# Altium schematic sheet smart-ring-main.SchDoc
size A2
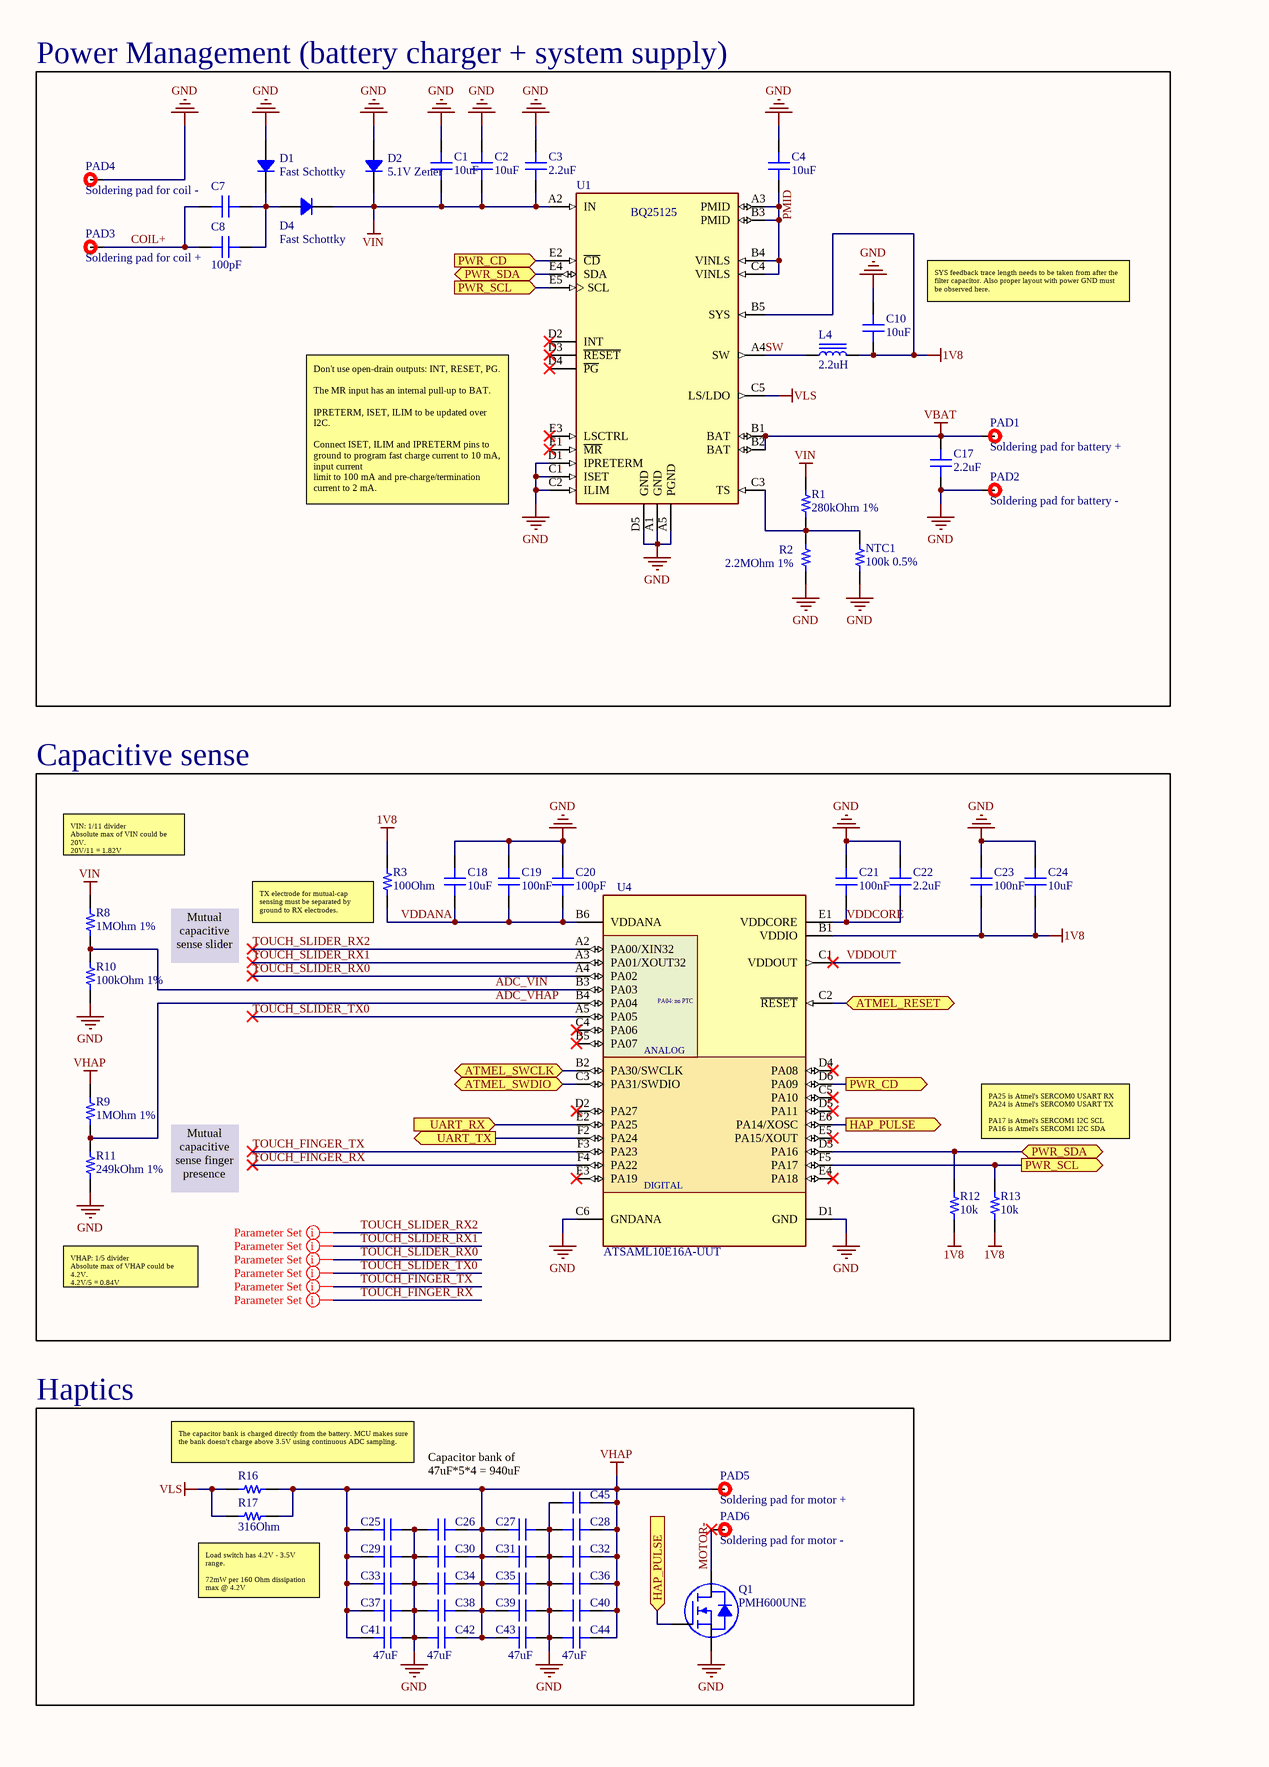
[diagram p0: smart-ring-main.SchDoc, left]
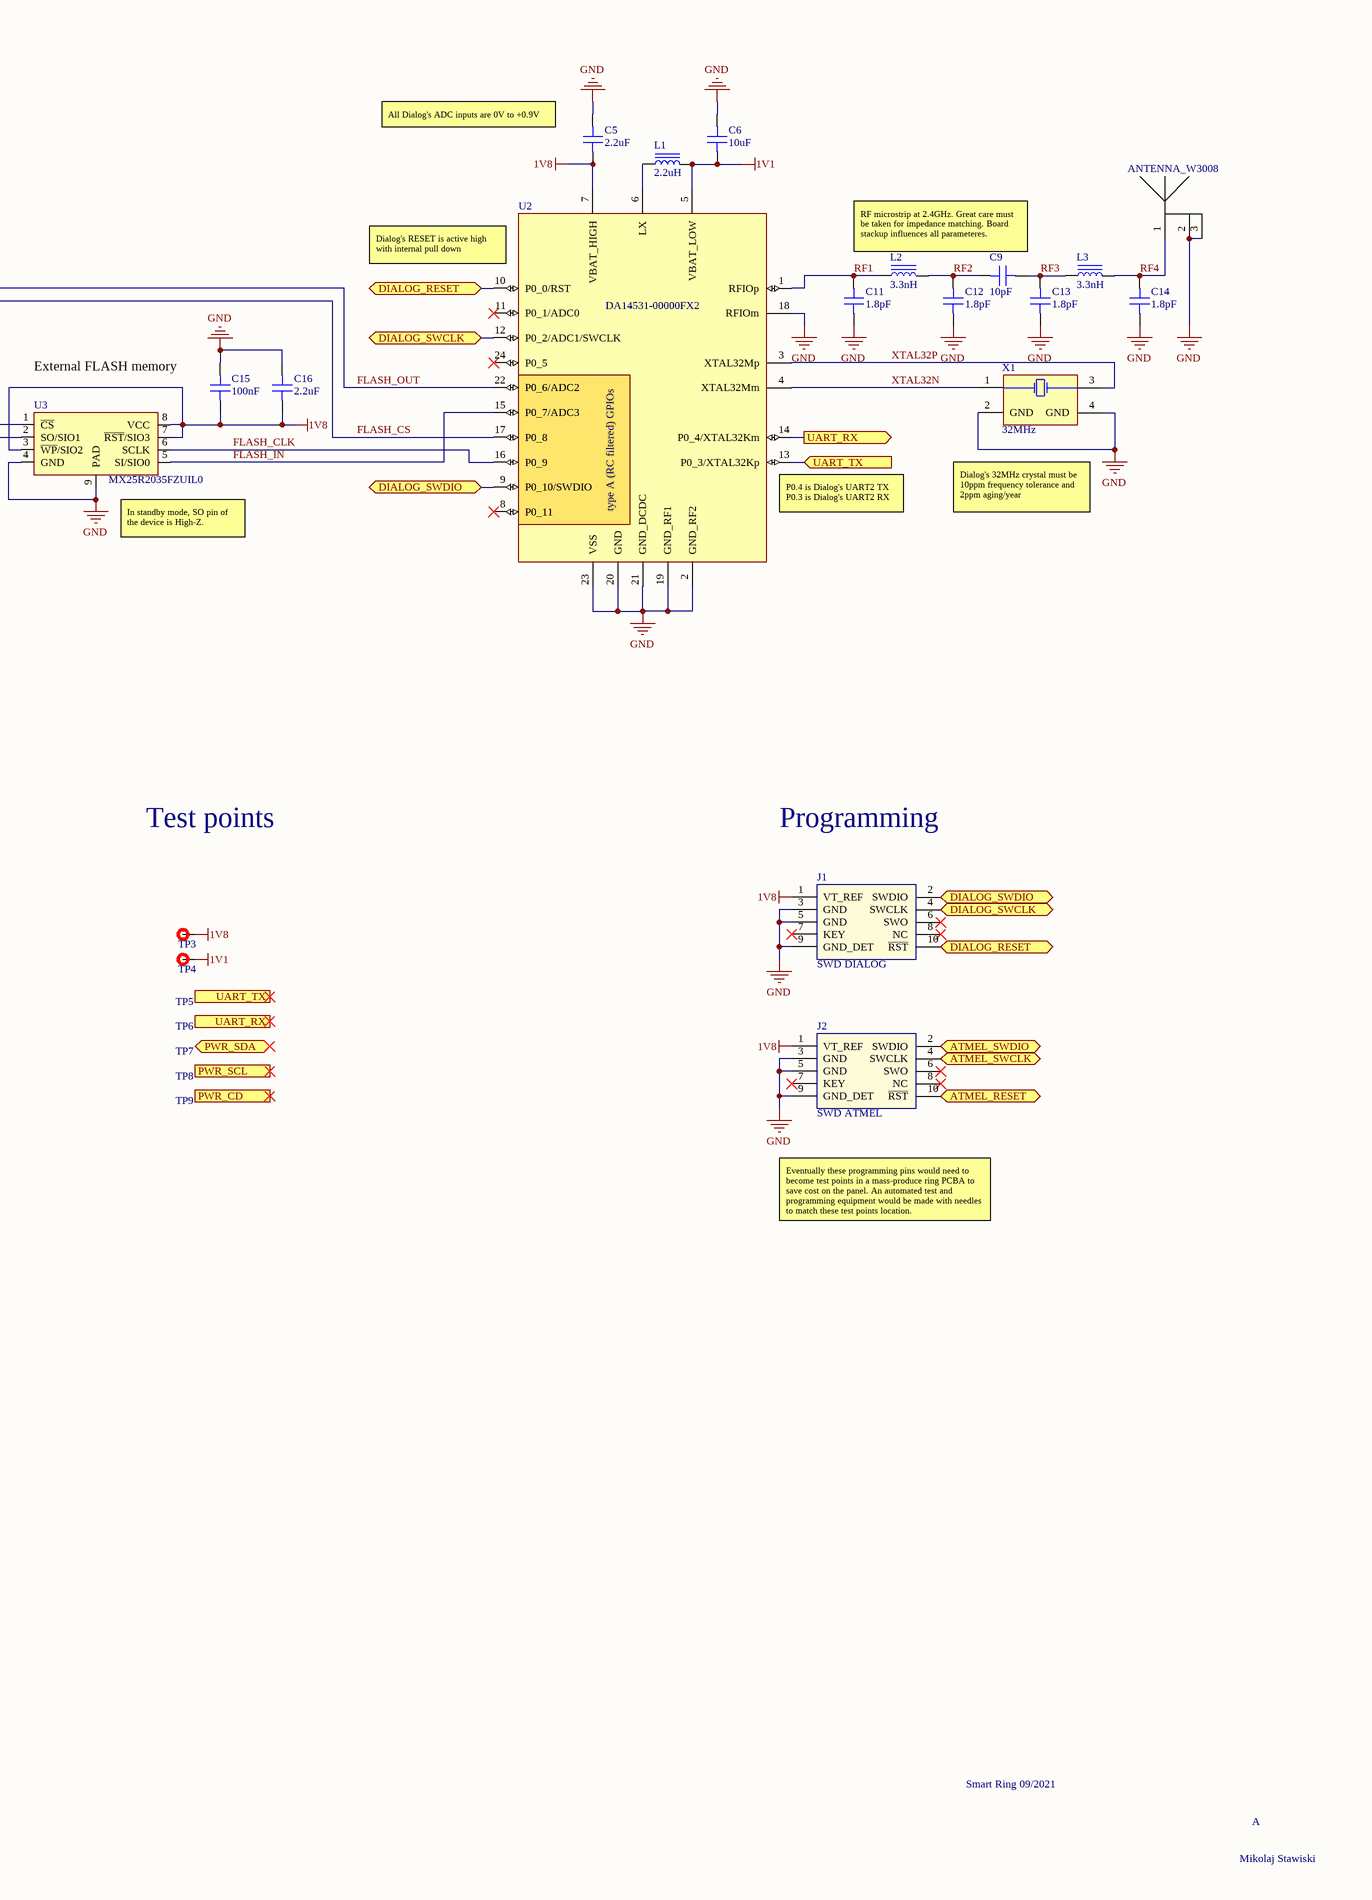
[diagram p1: smart-ring-main.SchDoc, right]

## Parts
C1  10uF  [SMD_CAPACITOR_0402]
C2  10uF  [SMD_CAPACITOR_0402]
C3  2.2uF  [SMD_CAPACITOR_0402]
C4  10uF  [SMD_CAPACITOR_0402]
C5  2.2uF  [SMD_CAPACITOR_0402]
C6  10uF  [SMD_CAPACITOR_0402]
C7  100pF  [SMD_CAPACITOR_0201]  (value not drawn)
C8  100pF  [SMD_CAPACITOR_0201]
C9  10pF  [SMD_CAPACITOR_0201]
C10  10uF  [SMD_CAPACITOR_0402]
C11  1.8pF  [SMD_CAPACITOR_0201]
C12  1.8pF  [SMD_CAPACITOR_0201]
C13  1.8pF  [SMD_CAPACITOR_0201]
C14  1.8pF  [SMD_CAPACITOR_0201]
C15  100nF  [SMD_CAPACITOR_0201]
C16  2.2uF  [SMD_CAPACITOR_0402]
C17  2.2uF  [SMD_CAPACITOR_0402]
C18  10uF  [SMD_CAPACITOR_0402]
C19  100nF  [SMD_CAPACITOR_0201]
C20  100pF  [SMD_CAPACITOR_0201]
C21  100nF  [SMD_CAPACITOR_0201]
C22  2.2uF  [SMD_CAPACITOR_0402]
C23  100nF  [SMD_CAPACITOR_0201]
C24  10uF  [SMD_CAPACITOR_0402]
C25  47uF  [SMD_CAPACITOR_0603]  (value not drawn)
C26  47uF  [SMD_CAPACITOR_0603]  (value not drawn)
C27  47uF  [SMD_CAPACITOR_0603]  (value not drawn)
C28  47uF  [SMD_CAPACITOR_0603]  (value not drawn)
C29  47uF  [SMD_CAPACITOR_0603]  (value not drawn)
C30  47uF  [SMD_CAPACITOR_0603]  (value not drawn)
C31  47uF  [SMD_CAPACITOR_0603]  (value not drawn)
C32  47uF  [SMD_CAPACITOR_0603]  (value not drawn)
C33  47uF  [SMD_CAPACITOR_0603]  (value not drawn)
C34  47uF  [SMD_CAPACITOR_0603]  (value not drawn)
C35  47uF  [SMD_CAPACITOR_0603]  (value not drawn)
C36  47uF  [SMD_CAPACITOR_0603]  (value not drawn)
C37  47uF  [SMD_CAPACITOR_0603]  (value not drawn)
C38  47uF  [SMD_CAPACITOR_0603]  (value not drawn)
C39  47uF  [SMD_CAPACITOR_0603]  (value not drawn)
C40  47uF  [SMD_CAPACITOR_0603]  (value not drawn)
C41  47uF  [SMD_CAPACITOR_0603]
C42  47uF  [SMD_CAPACITOR_0603]
C43  47uF  [SMD_CAPACITOR_0603]
C44  47uF  [SMD_CAPACITOR_0603]
C45  47uF  [SMD_CAPACITOR_0603]  (value not drawn)
D1  Fast Schottky  [CLP0603-2M]
D2  5.1V Zener  [DFN1006-2A]
D4  Fast Schottky  [CLP0603-2M]
J1  SWD DIALOG  [CONN_SWD_10PIN]
J2  SWD ATMEL  [CONN_SWD_10PIN]
L1  2.2uH  [SMD_INDUCTOR_0603]
L2  3.3nH  [SMD_INDUCTOR_0201]
L3  3.3nH  [SMD_INDUCTOR_0201]
L4  2.2uH  [SMD_INDUCTOR_0603_HDI]
NTC1  100k 0.5%  [SMD_RESISTOR_0402]
PAD1  Soldering pad for battery +  (graphical)
PAD2  Soldering pad for battery -  (graphical)
PAD3  Soldering pad for coil +  (graphical)
PAD4  Soldering pad for coil -  (graphical)
PAD5  Soldering pad for motor +  (graphical)
PAD6  Soldering pad for motor -  (graphical)
Q1  PMH600UNE  [DFN0606-3 (SOT8001)]
R1  280kOhm 1%  [SMD_RESISTOR_0201]
R2  2.2MOhm 1%  [SMD_RESISTOR_0201]
R3  100Ohm  [SMD_RESISTOR_0201]
R8  1MOhm 1%  [SMD_RESISTOR_0201]
R9  1MOhm 1%  [SMD_RESISTOR_0201]
R10  100kOhm 1%  [SMD_RESISTOR_0201]
R11  249kOhm 1%  [SMD_RESISTOR_0201]
R12  10k  [SMD_RESISTOR_0201]
R13  10k  [SMD_RESISTOR_0201]
R16  316Ohm  [SMD_RESISTOR_0201]  (value not drawn)
R17  316Ohm  [SMD_RESISTOR_0201]
TP3  Testpoint  [Testpoint 1.5x2.5mm]  (value not drawn)
TP4  Testpoint  [Testpoint 1.5x2.5mm]  (value not drawn)
U1  BQ25125  [BQ25125-DSBGA25_HDI]
U2  DA14531-00000FX2  [DA14531-00000FX2-FCGQFN24]
U3  MX25R2035FZUIL0  [USON-8L-2x3x0.6mm]
U4  ATSAML10E16A-UUT  [WLCSP32_HDI]
X1  32MHz  [ABM12W]
Y1  ANTENNA_W3008  [ANTENNA_W3008]

## Blocks framed on the sheet
Power Management (battery charger + system supply): C1-C4 C7 C8 C10 C17 D1 D2 D4 L4 NTC1 PAD1-PAD4 R1 R2 U1
Capacitive sense: C18-C24 R3 R8-R13 U4
Haptics: C25-C45 PAD5 PAD6 Q1 R16 R17

## Ports
ATMEL_RESET (bidir), ATMEL_SWCLK (bidir), ATMEL_SWDIO (bidir), DIALOG_RESET (bidir), DIALOG_SWCLK (bidir), DIALOG_SWDIO (bidir), HAP_PULSE (in), HAP_PULSE (out), PWR_CD (in), PWR_CD (out), PWR_SCL (in), PWR_SCL (out), PWR_SDA (bidir), UART_RX (in), UART_RX (out), UART_TX (in), UART_TX (out)

## Nets
1V1: C6.1 L1.2 TP4.1 U2.5(VBAT_LOW)
1V8: C5.1 C10.1 C15.1 C16.1 C23.1 C24.1 J1.1(VT_REF) J2.1(VT_REF) L4.2 R3.2 R12.2 R13.2 TP3.1 U1.B5(SYS) U2.7(VBAT_HIGH) U3.3(~{WP}/SIO2) U3.7(~{RST}/SIO3) U3.8(VCC) U4.B1(VDDIO)
GND: C1.2 C2.2 C3.2 C4.2 C5.2 C6.2 C10.2 C11.1 C12.1 C13.1 C14.1 C15.2 C16.2 C17.1 C18.2 C19.2 C20.2 C21.2 C22.2 C23.2 C24.2 C25.2 C26.1 C27.2 C28.1 C29.1 C30.1 C31.2 C32.1 C33.2 C34.1 C35.2 C36.1 C37.2 C38.1 C39.2 C40.1 C41.2 C42.1 C43.2 C44.1 C45.1 D1.1 D2.1 J1.3(GND) J1.5(GND) J1.9(GND_DET) J2.3(GND) J2.5(GND) J2.9(GND_DET) NTC1.1 PAD2.1 PAD4.1 Q1.S R2.2 R10.1 R11.1 U1.A1(GND) U1.A5(PGND) U1.C1(ISET) U1.C2(ILIM) U1.D1(IPRETERM) U1.D5(GND) U2.2(GND_RF2) U2.18(RFIOm) U2.19(GND_RF1) U2.20(GND) U2.21(GND_DCDC) U2.23(VSS) U3.4(GND) U3.9(PAD) U4.C6(GNDANA) U4.D1(GND) X1.2(GND) X1.4(GND) Y1.2(GND) Y1.3(GND)
VBAT: C17.2 PAD1.1 U1.B1(BAT) U1.B2(BAT)
VHAP: C25.1 C26.2 C27.1 C28.2 C29.2 C30.2 C31.1 C32.2 C33.1 C34.2 C35.1 C36.2 C37.1 C38.2 C39.1 C40.2 C41.1 C42.2 C43.1 C44.2 C45.2 PAD5.1 R9.2 R16.1 R17.1
VIN: C1.1 C2.1 C3.1 D2.2 D4.2 R1.1 R8.2 U1.A2(IN)
VLS: R16.2 R17.2 U1.C5(LS/LDO)
ADC_VHAP: R9.1 R11.2 U4.B4(PA04)
ADC_VIN: R8.1 R10.2 U4.B3(PA03)
ATMEL_RESET: J2.10(~{RST}) U4.C2(~{RESET}) ; port ATMEL_RESET
ATMEL_SWCLK: J2.4(SWCLK) U4.B2(PA30/SWCLK) ; port ATMEL_SWCLK
ATMEL_SWDIO: J2.2(SWDIO) U4.C3(PA31/SWDIO) ; port ATMEL_SWDIO
COIL+: C7.2 C8.2 PAD3.1
DIALOG_RESET: J1.10(~{RST}) U2.10(P0_0/RST) ; port DIALOG_RESET
DIALOG_SWCLK: J1.4(SWCLK) U2.12(P0_2/ADC1/SWCLK) ; port DIALOG_SWCLK
DIALOG_SWDIO: J1.2(SWDIO) U2.9(P0_10/SWDIO) ; port DIALOG_SWDIO
FLASH_CLK: U2.16(P0_9) U3.6(SCLK)
FLASH_CS: U2.17(P0_8) U3.1(~{CS})
FLASH_IN: U2.15(P0_7/ADC3) U3.5(SI/SIO0)
FLASH_OUT: U2.22(P0_6/ADC2) U3.2(SO/SIO1)
HAP_PULSE: Q1.G U4.E6(PA14/XOSC) ; port HAP_PULSE
MOTOR-: PAD6.1 Q1.D
PMID: C4.1 U1.A3(PMID) U1.B3(PMID) U1.B4(VINLS) U1.C4(VINLS)
PWR_CD: U1.E2(~{CD}) U4.D6(PA09) ; port PWR_CD
PWR_SCL: R13.1 U1.E5(SCL) U4.F5(PA17) ; port PWR_SCL
PWR_SDA: R12.1 U1.E4(SDA) U4.D3(PA16) ; port PWR_SDA
RF1: C11.2 L2.1 U2.1(RFIOp)
RF2: C9.2 C12.2 L2.2
RF3: C9.1 C13.2 L3.1
RF4: C14.2 L3.2 Y1.1(RF)
SW: L4.1 U1.A4(SW)
TOUCH_FINGER_RX: U4.F4(PA22)
TOUCH_FINGER_TX: U4.F3(PA23)
TOUCH_SLIDER_RX0: U4.A4(PA02)
TOUCH_SLIDER_RX1: U4.A3(PA01/XOUT32)
TOUCH_SLIDER_RX2: U4.A2(PA00/XIN32)
TOUCH_SLIDER_TX0: U4.A5(PA05)
UART_RX: U2.14(P0_4/XTAL32Km) U4.E2(PA25) ; port UART_RX
UART_TX: U2.13(P0_3/XTAL32Kp) U4.F2(PA24) ; port UART_TX
VDDANA: C18.1 C19.1 C20.1 R3.1 U4.B6(VDDANA)
VDDCORE: C21.1 C22.1 U4.E1(VDDCORE)
VDDOUT: U4.C1(VDDOUT)
XTAL32N: U2.4(XTAL32Mm) X1.1(X1)
XTAL32P: U2.3(XTAL32Mp) X1.3(X2)
NetC7_1: C7.1 C8.1 D1.2 D4.1
NetL1_1: L1.1 U2.6(LX)
NetNTC1_2: NTC1.2 R1.2 R2.1 U1.C3(TS)

Not connected (* = marked no-connect by the designer): J1 6(SWO)* 7(KEY)* 8(NC)*; J2 6(SWO)* 7(KEY)* 8(NC)*; U1 D2(INT)* D3(~{RESET})* D4(~{PG})* E1(~{MR})* E3(LSCTRL)*; U2 8(P0_11)* 11(P0_1/ADC0)* 24(P0_5)*; U4 B5(PA07)* C4(PA06)* C5(PA10)* D2(PA27)* D4(PA08)* D5(PA11)* E3(PA19)* E4(PA18)* E5(PA15/XOUT)*

## Layout directives
net class TOUCH: TOUCH_FINGER_RX, TOUCH_FINGER_TX, TOUCH_SLIDER_RX0, TOUCH_SLIDER_RX1, TOUCH_SLIDER_RX2, TOUCH_SLIDER_TX0

## Notes on the sheet
- (near C5) All Dialog's ADC inputs are 0V to +0.9V
- RF microstrip at 2.4GHz. Great care must be taken for impedance matching. Board stackup influences all parameteres.
- SYS feedback trace length needs to be taken from after the filter capacitor. Also proper layout with power GND must be observed here.
- (near U2) Dialog's RESET is active high with internal pull down
- External FLASH memory
- Don't use open-drain outputs: INT, RESET, PG.
  The MR input has an internal pull-up to BAT.
  IPRETERM, ISET, ILIM to be updated over I2C.
  Connect ISET, ILIM and IPRETERM pins to ground to program fast charge current to 10 mA, input current
  limit to 100 mA and pre-charge/termination current to 2 mA.
- (near U3) In standby mode, SO pin of the device is High-Z.
- (near U2) P0.4 is Dialog's UART2 TX
  P0.3 is Dialog's UART2 RX
- Dialog's 32MHz crystal must be 10ppm frequency tolerance and 2ppm aging/year
- VIN: 1/11 divider
  Absolute max of VIN could be 20V.
  20V/11 = 1.82V
- Mutual capacitive sense slider
- (near R3) TX electrode for mutual-cap sensing must be separated by ground to RX electrodes.
- Test points
- Programming
- (near U4) PA04: no PTC
- PA25 is Atmel's SERCOM0 USART RX
  PA24 is Atmel's SERCOM0 USART TX
  PA17 is Atmel's SERCOM1 I2C SCL
  PA16 is Atmel's SERCOM1 I2C SDA
- (near TP4) TP5
- TP6
- TP7
- Mutual capacitive sense finger presence
- TP8
- TP9
- VHAP: 1/5 divider
  Absolute max of VHAP could be 4.2V.
  4.2V/5 = 0.84V
- Eventually these programming pins would need to become test points in a mass-produce ring PCBA to save cost on the panel. An automated test and programming equipment would be made with needles to match these test points location.
- (near R16) The capacitor bank is charged directly from the battery. MCU makes sure the bank doesn't charge above 3.5V using continuous ADC sampling.
- (near C45) Capacitor bank of
  47uF*5*4 = 940uF
- (near R17) Load switch has 4.2V - 3.5V range.
  72mW per 160 Ohm dissipation max @ 4.2V
- Smart Ring 09/2021
- Mikolaj Stawiski
- A
- (in symbol ATSAML10EXXA-U) ANALOG; DIGITAL
- (in symbol DA14531-00000FX2) type A (RC filtered) GPIOs

## Library data of the parts
C1 C2 C4 C6 C10 C18 C24 = CAPACITOR_0402: Ceramic Capacitor 10uF 20% 10V X5R 0402; Part Number: CL05A106MP5NUNC; Manufacturer: Samsung; Value: 10uF; Device Package: 0402 (1005 Metric); Mounting Type: SMT; Operating Temperature: *; Size / Dimension: 0.039" L x 0.020" W (1.00mm x 0.50mm); Thickness (Max): *; Tolerance: 20%; Voltage - Rated: 10V; Digikey link: https://www.digikey.com/en/products/detail/samsung-electro-mechanics/CL05A106MP5NUNC/3887108?s=N4IgTCBcDaIMIBkAMBWAggRiQNgLIAUUA5AVSLhAF0BfIA; Mouser link: https://au.mouser.com/ProductDetail/Samsung-Electro-Mechanics/CL05A106MP5NUNC/?qs=%2Fha2pyFadujQ7YcBKb35%2FBbJvrfEs4Xc1j9gkwHKSo5FkZmFQOJR1A%3D%3D
C3 C5 C16 C17 C22 = CAPACITOR_0402: Ceramic Capacitor 2.2uF 20% 6.3V X5R 0402; Part Number: GRM155R60J225ME15D; Manufacturer: Murata; Value: 2.2uF; Device Package: 0402 (1005 Metric); Mounting Type: SMT; Operating Temperature: *; Size / Dimension: 0.039" L x 0.020" W (1.00mm x 0.50mm); Thickness (Max): *; Tolerance: 20%; Voltage - Rated: 6.3V; Digikey link: https://www.digikey.com.au/product-detail/en/murata-electronics/GRM155R60J225ME15D/490-4519-1-ND/1033278; Mouser link: *
C7 C8 C20 = CAPACITOR_0201: Ceramic capacitor 100pF 10% 16V X7R 0201; Part Number: GRM033R71C101KA01D; Manufacturer: Murata; Value: 100pF; Device Package: 0201 (0603 Metric); Mounting Type: SMT; Operating Temperature: *; Size / Dimension: 0.024" L x 0.012" W (0.60mm x 0.30mm); Thickness (Max): *; Tolerance: 10%; Voltage - Rated: 16V; Digikey link: https://www.digikey.com.au/product-detail/en/murata-electronics/GRM033R71C101KA01D/490-6146-2-ND/2543500; Mouser link: *
C9 = CAPACITOR_0201: Ceramic Capacitor 10pF ±0.25pF 50V C0G (NP0) 0201; Part Number: 02013A100CAT2A; Manufacturer: AVX; Value: 10pF; Device Package: 0201 (0603 Metric); Mounting Type: SMT; Operating Temperature: *; Size / Dimension: 0.024" L x 0.012" W (0.60mm x 0.30mm); Thickness (Max): *; Tolerance: 0.25pF; Voltage - Rated: *; Digikey link: https://www.digikey.com.au/product-detail/en/avx-corporation/02013A100CAT2A/478-02013A100CAT2ACT-ND/11570361; Mouser link: *
C11-C14 = CAPACITOR_0201: Ceramic Capacitor 1.8pF ±0.25pF 50V C0G (NP0) 0201; Part Number: GRM0335C1H1R8CA01D; Manufacturer: Murata; Value: 1.8pF; Device Package: 0201 (0603 Metric); Mounting Type: SMT; Operating Temperature: *; Size / Dimension: 0.024" L x 0.012" W (0.60mm x 0.30mm); Thickness (Max): *; Tolerance: 0.25pF; Voltage - Rated: *; Digikey link: https://www.digikey.com.au/product-detail/en/murata-electronics/GRM0335C1H1R8CA01D/490-11314-1-ND/5333154; Mouser link: *
C15 C19 C21 C23 = CAPACITOR_0201: Ceramic capacitor 100nF 10% 6.3V X5R 0201; Part Number: GRM033R60J104KE19J; Manufacturer: Murata; Value: 100nF; Device Package: 0201 (0603 Metric); Mounting Type: SMT; Operating Temperature: *; Size / Dimension: 0.024" L x 0.012" W (0.60mm x 0.30mm); Thickness (Max): *; Tolerance: 10%; Voltage - Rated: 6.3V; Digikey link: https://www.digikey.com.au/product-detail/en/murata-electronics/GRM033R60J104KE19J/490-8155-2-ND/2543452; Mouser link: *
C25-C45 = CAPACITOR_0603: Ceramic Capacitor 47uF 20% 4V X5R 0603; Part Number: GRM188R60G476ME15D; Manufacturer: Murata; Value: 47uF; Device Package: 0603 (1608 Metric); Mounting Type: SMT; Operating Temperature: *; Size / Dimension: 0.063" L x 0.031" W (1.60mm x 0.80mm); Thickness (Max): *; Tolerance: 20%; Voltage - Rated: 4V; Digikey link: https://www.digikey.com.au/product-detail/en/murata-electronics/GRM188R60G476ME15D/490-13246-1-ND/5877454; Mouser link: *
D1 D4 = DIODE_0201: Diode SMT 0201; Part Number: VSKY02300603; Manufacturer: Vishay; Value: Fast Schottky; Device Package: 0201 (0603 Metric); Mounting Type: SMT; Operating Temperature: *; Size / Dimension: 0.024" L x 0.012" W (0.60mm x 0.30mm); Thickness (Max): *; Tolerance: *; Voltage - Rated: *; Distributor link 1: https://www.digikey.com/en/products/detail/vishay-general-semiconductor-diodes-division/VSKY02300603-G4-08/7390849; Distributor link 2: *; Distributor link 3: *
D2 = DIODE_0201: Diode SMT 0201; Part Number: BZX884B5V1L; Manufacturer: Vishay; Value: 5.1V Zener; Device Package: 0402 (1006 Metric); Mounting Type: SMT; Operating Temperature: *; Thickness (Max): *; Tolerance: *; Voltage - Rated: *; Distributor link 1: https://www.digikey.com.au/en/products/detail/vishay-general-semiconductor-diodes-division/BZX884B5V1L-HG3-08/14312734; Distributor link 2: *; Distributor link 3: *
J1 J2 = CONN_SWD_10PIN: 10-pin ARM SWD connector for debugging; Manufacturer: Samtec; Part Number: FTSH-105-01-L-DV-K
L1 L4 = INDUCTOR_0603: Inductor fixed 2.2uH 20% 500mA 180mOhm 0603; Part Number: MLZ1608N2R2LT000; Manufacturer: TDK; Value: 2.2uH; Device Package: 0603 (1608 Metric); Mounting Type: SMT; Operating Temperature: *; Size / Dimension: 0.063" L x 0.031" W (1.60mm x 0.80mm); Thickness (Max): *; Tolerance: 20%; Voltage - Rated: *; Digikey link: https://www.digikey.com.au/product-detail/en/tdk-corporation/MLZ1608N2R2LT000/445-6754-1-ND/2523575; Mouser link: *
L2 L3 = INDUCTOR_0201: RF Inductor 3.3nH ±0.1nH 450mA 250mOhm 0201; Part Number: LQP03TN3N3B02D; Manufacturer: Murata; Value: 3.3nH; Device Package: 0201 (0603 Metric); Mounting Type: SMT; Operating Temperature: *; Size / Dimension: 0.024" L x 0.012" W (0.60mm x 0.30mm); Thickness (Max): *; Tolerance: 0.1nH; Voltage - Rated: *; Digikey link: https://www.digikey.com.au/product-detail/en/murata-electronics/LQP03TN3N3B02D/490-6728-1-ND/5802375; Mouser link: *
NTC1 = RESISTOR_0402: Resistor SMT 0402; Part Number: NTCG104ED104DT1X; Manufacturer: TDK; Value: 100k 0.5%; Device Package: 0402 (1005 Metric); Mounting Type: SMT; Operating Temperature: *; Size / Dimension: 0.039" L x 0.020" W (1.00mm x 0.50mm); Thickness (Max): *; Tolerance: 0.5%; Voltage - Rated: *; Distributor link 1: https://www.digikey.com.au/en/products/detail/tdk-corporation/NTCG104ED104DT1X/8565495; Distributor link 2: *; Distributor link 3: *
PAD1-PAD6 = Testpoint
Q1 = MOSFET_N_GDS: N-MOSFET SMT; Manufacturer: Nexperia USA Inc.; Voltage - Rated: 20V; Part Number: PMH600UNE; Value: PMH600UNE; Device Package: 3-XFDFN; Mounting Type: SMT; Operating Temperature: -55°C ~ 150°C (TJ); Size / Dimension: *; Thickness (Max): *; Distributor link 1: https://www.digikey.com.au/product-detail/en/nexperia-usa-inc/PMH600UNEH/1727-8580-1-ND/10261006; Distributor link 2: *; Distributor link 3: *
R1 R2 R12 R13 = RESISTOR_0201: Resistor 470 Ohm 5% 1/20W 0201; Device Package: 0201 (0603 Metric); Mounting Type: SMT; Operating Temperature: *; Size / Dimension: 0.024" L x 0.012" W (0.60mm x 0.30mm); Thickness (Max): *; Voltage - Rated: *; Mouser link: *
  R1: Value: 280kOhm 1%; Tolerance: 1%
  R2: Value: 2.2MOhm 1%; Tolerance: 1%
  R12 R13: Value: 10k; Tolerance: 5%
R3 = RESISTOR_0201: Resistor 100 Ohm 5% 1/20W 0201; Part Number: RC0201JR-07100RL; Manufacturer: Yageo; Value: 100Ohm; Device Package: 0201 (0603 Metric); Mounting Type: SMT; Operating Temperature: *; Size / Dimension: 0.024" L x 0.012" W (0.60mm x 0.30mm); Thickness (Max): *; Tolerance: 5%; Voltage - Rated: *; Digikey link: https://www.digikey.com.au/product-detail/en/yageo/RC0201JR-07100RL/311-100NCT-ND/1949006; Mouser link: *
R8 R9 = RESISTOR_0201: Resistor 1 MOhm 1% 1/20W 0201; Value: 1MOhm 1%; Device Package: 0201 (0603 Metric); Mounting Type: SMT; Operating Temperature: *; Size / Dimension: 0.024" L x 0.012" W (0.60mm x 0.30mm); Thickness (Max): *; Tolerance: 1%; Voltage - Rated: *; Mouser link: *
R10 R11 = RESISTOR_0201: Resistor 249 kOhm 1% 1/20W 0201; Device Package: 0201 (0603 Metric); Mounting Type: SMT; Operating Temperature: *; Size / Dimension: 0.024" L x 0.012" W (0.60mm x 0.30mm); Thickness (Max): *; Tolerance: 1%; Voltage - Rated: *; Mouser link: *
  R10: Value: 100kOhm 1%
  R11: Value: 249kOhm 1%
R16 R17 = RESISTOR_0201: Resistor 316 Ohm 1% 1/20W 0201; Part Number: CRCW0201316RFNED; Manufacturer: Vishay Dale; Value: 316Ohm; Device Package: 0201 (0603 Metric); Mounting Type: SMT; Operating Temperature: *; Size / Dimension: 0.024" L x 0.012" W (0.60mm x 0.30mm); Thickness (Max): *; Tolerance: 1%; Voltage - Rated: *; Digikey link: https://www.digikey.com.au/product-detail/en/vishay-dale/CRCW0201316RFNED/541-CRCW0201316RFNEDCT-ND/10448813; Mouser link: *
TP3 TP4 = Testpoint: Testpoint for measuring at the PCB
U1 = BQ25125: BQ25125 Low IQ Highly Integrated Battery Charge Management Solution / For Wearables and IoT
U2 = DA14531-00000FX2: IC RF TxRx + MCU Bluetooth Bluetooth v5.1 2.4GHz 24-WFQFN, FC; Manufacturer: Dialog Semiconductor GmbH; Package: WFQFN-24 Dialog Semiconductor GmbH
U3 = MX25R2035FZUIL0: Manufacturer: Macronix
U4 = ATSAML10EXXA-U: ARM® Cortex®-M23 SAM L10 Microcontroller IC 32-Bit 32MHz 16-64KB FLASH 32-WLCSP (2.79 x 2.79); Manufacturer: Microchip (Atmel); Part Number: ATSAML10E16A-UUT; Value: ATSAML10E16A-UUT; Device Package: WLCSP-32; Mounting Type: SMT; Operating Temperature: *; Size / Dimension: *; Thickness (Max): *; Distributor link 1: *; Distributor link 2: *; Distributor link 3: *; Link: https://www.microchip.com/wwwproducts/en/ATSAML10E16A
X1 = CRYSTAL_4PIN_GENERIC: Crystal 32MHz 7pF ±10ppm for Bluetooth (1.60mm x 1.20mm); Part Number: ABM12W-32.0000MHZ-7-B1U-T3; Manufacturer: Abracon; Value: 32MHz; Device Package: 4-SMD, No Lead; Mounting Type: SMT; Operating Temperature: -20°C ~ 70°C; Size / Dimension: 0.063" L x 0.047" W (1.60mm x 1.20mm); Thickness (Max): *; Voltage - Rated: *; Distributor link 1: https://www.digikey.com.au/product-detail/en/abracon-llc/ABM12W-32-0000MHZ-7-B1U-T3/535-ABM12W-32-0000MHZ-7-B1U-T3CT-ND/7173160; Distributor link 2: *; Distributor link 3: *